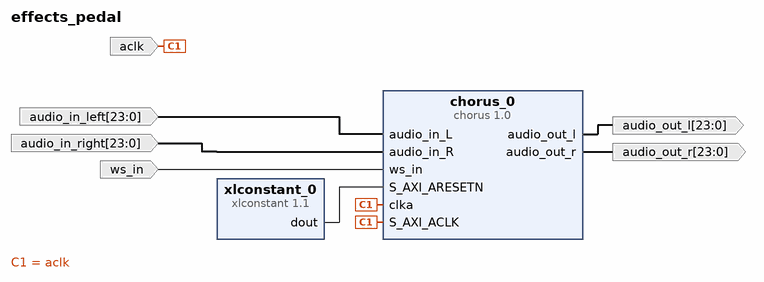
[diagram p0: block diagram of the top level]
# Vivado block design effects_pedal, xc7a100tcsg324-1, Vivado 2022.2
create_bd_design effects_pedal

create_bd_port -dir I -type clk aclk
set_property -dict {CONFIG.FREQ_HZ 11289000} [get_bd_ports aclk]
create_bd_port -dir I -type clk ws_in
set_property -dict {CONFIG.FREQ_HZ 44000} [get_bd_ports ws_in]
create_bd_port -dir I -from 23 -to 0 audio_in_left
create_bd_port -dir I -from 23 -to 0 audio_in_right
create_bd_port -dir O -from 23 -to 0 audio_out_l
create_bd_port -dir O -from 23 -to 0 audio_out_r

create_bd_cell -type ip -vlnv xilinx.com:ip:xlconstant:1.1 xlconstant_0
set_property -dict {CONFIG.CONST_VAL 0} [get_bd_cells xlconstant_0]
create_bd_cell -type ip -vlnv xilinx.com:user:chorus:1.0 chorus_0

# ---- connections ----

connect_bd_net [get_bd_ports aclk] [get_bd_pins chorus_0/clka] [get_bd_pins chorus_0/S_AXI_ACLK]
connect_bd_net [get_bd_ports audio_in_left] [get_bd_pins chorus_0/audio_in_L]
connect_bd_net [get_bd_ports audio_in_right] [get_bd_pins chorus_0/audio_in_R]
connect_bd_net [get_bd_pins chorus_0/audio_out_l] [get_bd_ports audio_out_l]
connect_bd_net [get_bd_pins chorus_0/audio_out_r] [get_bd_ports audio_out_r]
connect_bd_net [get_bd_ports ws_in] [get_bd_pins chorus_0/ws_in]
connect_bd_net [get_bd_pins xlconstant_0/dout] [get_bd_pins chorus_0/S_AXI_ARESETN]

validate_bd_design
save_bd_design
